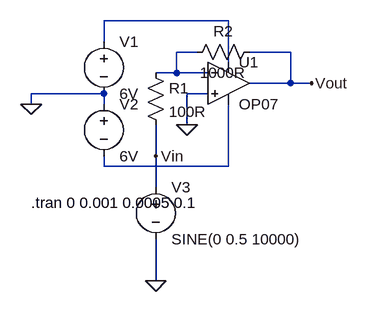
[diagram p0: schematic Inverting amplifier.asc]
Inverting amplifier.asc, the LTspice schematic file:
Version 4
SHEET 1 880 680
WIRE 224 64 32 64
WIRE 32 96 32 64
WIRE 176 112 144 112
WIRE 320 112 256 112
WIRE 224 128 224 64
WIRE 144 144 144 112
WIRE 144 144 112 144
WIRE 192 144 144 144
WIRE 320 160 320 112
WIRE 320 160 256 160
WIRE 352 160 320 160
WIRE 32 176 -80 176
WIRE 192 176 160 176
WIRE -80 192 -80 176
WIRE 32 192 32 176
WIRE 160 224 160 176
WIRE 112 272 112 224
WIRE 32 288 32 272
WIRE 224 288 224 192
WIRE 224 288 32 288
WIRE 112 320 112 272
WIRE 112 464 112 400
FLAG 112 464 0
FLAG -80 192 0
FLAG 160 224 0
FLAG 112 272 Vin
FLAG 352 160 Vout
SYMBOL voltage 32 80 R0
SYMATTR InstName V1
SYMATTR Value 6V
SYMBOL voltage 32 176 R0
SYMATTR InstName V2
SYMATTR Value 6V
SYMBOL OpAmps\\OP07 224 96 R0
SYMATTR InstName U1
SYMBOL voltage 112 304 R0
WINDOW 123 0 0 Left 0
WINDOW 39 0 0 Left 0
SYMATTR InstName V3
SYMATTR Value SINE(0 0.5 10000)
SYMBOL res 96 128 R0
SYMATTR InstName R1
SYMATTR Value 100R
SYMBOL res 272 96 R90
WINDOW 0 0 56 VBottom 2
WINDOW 3 32 56 VTop 2
SYMATTR InstName R2
SYMATTR Value 1000R
TEXT -80 344 Left 2 !.tran 0 0.001 0.0005 0.1

The netlist it stands for:
* Inverting amplifier.asc
V1 N001 0 6V
V2 0 N003 6V
XU1 0 N002 N001 N003 Vout LT1001  ; OP07, pins In+ In- V+ V- OUT
V3 Vin 0 SINE(0 0.5 10000)
R1 N002 Vin 100R
R2 Vout N002 1000R
.tran 0 0.001 0.0005 0.1
.lib LTC.lib
.backanno
.end